# Altium project ZQS_PCB_Project.PrjPcb
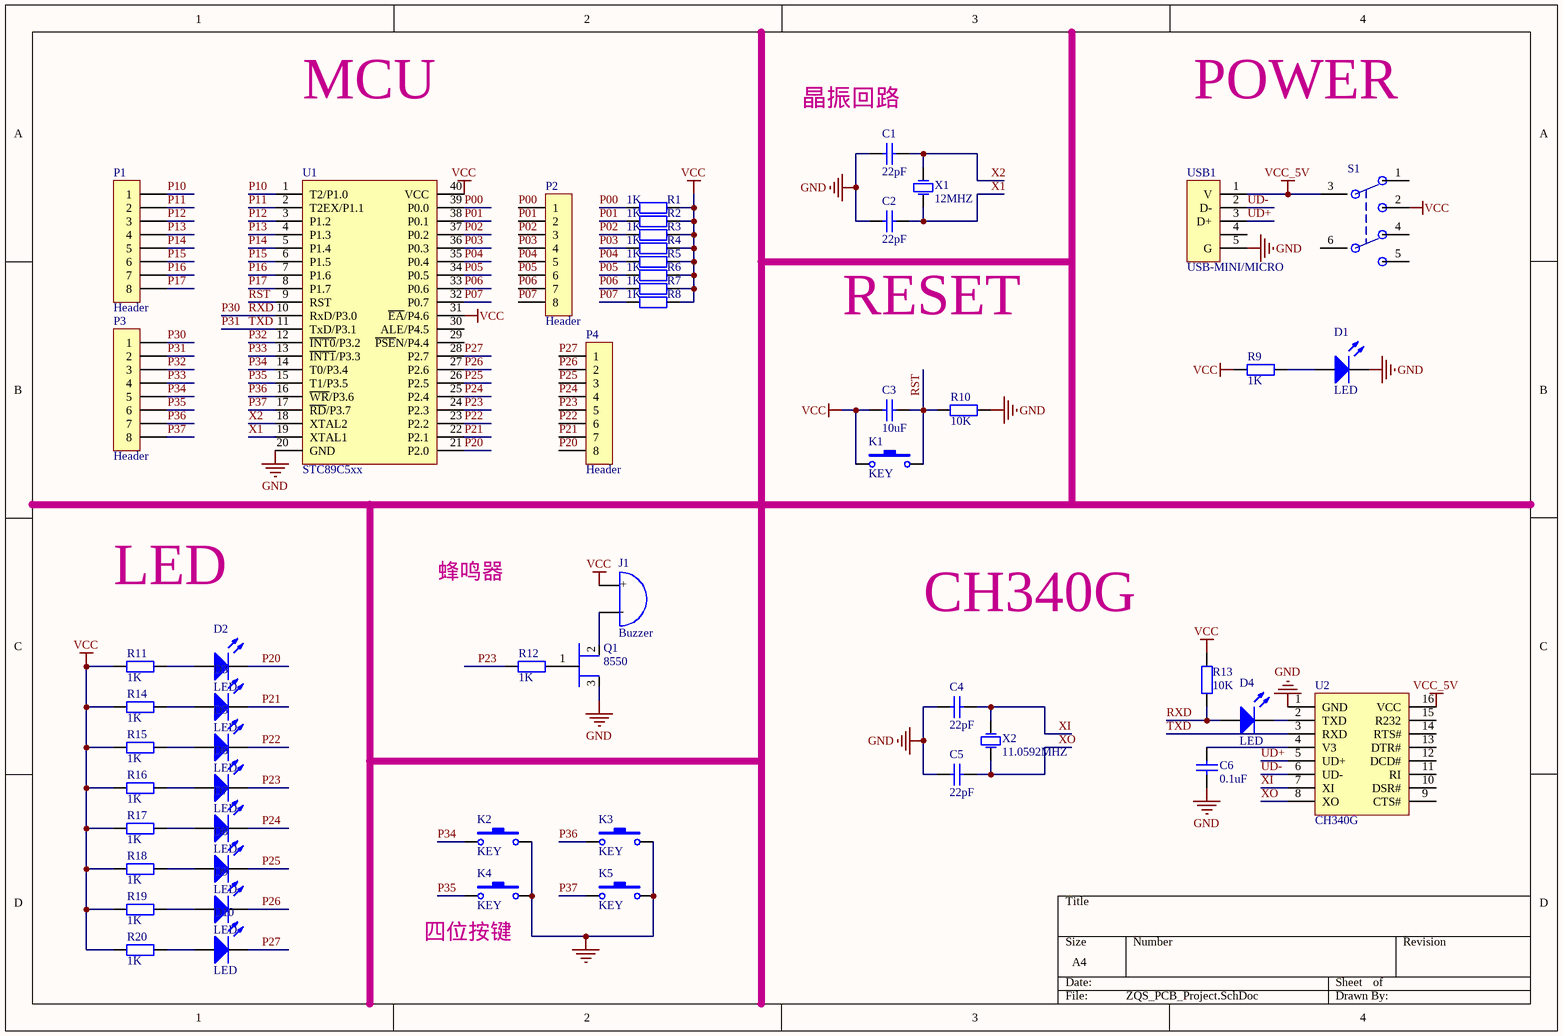
[diagram p0: ZQS_PCB_Project.SchDoc]
1 sheet, 53 parts. Net scope: global (net labels, ports and power ports of the same name join across sheets).
Board file: ZQS_PCB_Project.PcbDoc

## Sheet ZQS_PCB_Project.SchDoc
size A4; SheetNumber: 1; SheetTotal: 1

### Parts
C1  22pF  [C0603]
C2  22pF  [C0603]
C3  10uF  [C0603]
C4  22pF  [C0603]
C5  22pF  [C0603]
C6  0.1uF  [C0603]
D1  LED  [LED-G]
D2  LED  [LED-B]
D3  LED  [LED-B]
D4  LED  [LED-G]
D5  LED  [LED-G]
D6  LED  [LED-G]
D7  LED  [LED-R]
D8  LED  [LED-R]
D9  LED  [LED-Y]
D10  LED  [LED-Y]
J1  Buzzer  [Buzzer]
K1  KEY  [KEY]
K2  KEY  [KEY]
K3  KEY  [KEY]
K4  KEY  [KEY]
K5  KEY  [KEY]
P1  Header  [HDR2.54-M-LI-8P]
P2  Header  [HDR2.54-M-LI-8P]
P3  Header  [HDR2.54-M-LI-8P]
P4  Header  [HDR2.54-M-LI-8P]
Q1  8550  [SOT-23-3]
R1  1K  [R0603]
R2  1K  [R0603]
R3  1K  [R0603]
R4  1K  [R0603]
R5  1K  [R0603]
R6  1K  [R0603]
R7  1K  [R0603]
R8  1K  [R0603]
R9  1K  [R0603]
R10  10K  [R0603]
R11  1K  [R0603]
R12  1K  [R0603]
R13  10K  [R0603]
R14  1K  [R0603]
R15  1K  [R0603]
R16  1K  [R0603]
R17  1K  [R0603]
R18  1K  [R0603]
R19  1K  [R0603]
R20  1K  [R0603]
S1  (no value)  [swtich-6pin]
U1  STC89C5xx  [STC89C5X]
U2  CH340G  [SOIC-16_150mil]
USB1  USB-MINI/MICRO  [USB-MICRO2]
X1  12MHZ  [XTAL_HC49SMD]
X2  11.0592MHZ  [XTAL_HC49SMD]

### Nets
GND: C1.1 C2.1 C4.2 C5.2 C6.1 D1.2(K) K2.2 K3.2 K4.2 K5.2 Q1.3 R10.2 U1.20(GND) U2.1(GND) USB1.5(G)
VCC: C3.1 J1.1(A) K1.1 R1.2 R2.2 R3.2 R4.2 R5.2 R6.2 R7.2 R8.2 R9.1 R11.1 R13.2 R14.1 R15.1 R16.1 R17.1 R18.1 R19.1 R20.1 S1.2 U1.31(~{EA}/P4.6) U1.40(VCC)
VCC_5V: S1.3 U2.16(VCC) USB1.1(V)
P00: P2.1 R1.1 U1.39(P0.0)
P01: P2.2 R2.1 U1.38(P0.1)
P02: P2.3 R3.1 U1.37(P0.2)
P03: P2.4 R4.1 U1.36(P0.3)
P04: P2.5 R5.1 U1.35(P0.4)
P05: P2.6 R6.1 U1.34(P0.5)
P06: P2.7 R7.1 U1.33(P0.6)
P07: P2.8 R8.1 U1.32(P0.7)
P10: P1.1 U1.1(T2/P1.0)
P11: P1.2 U1.2(T2EX/P1.1)
P12: P1.3 U1.3(P1.2)
P13: P1.4 U1.4(P1.3)
P14: P1.5 U1.5(P1.4)
P15: P1.6 U1.6(P1.5)
P16: P1.7 U1.7(P1.6)
P17: P1.8 U1.8(P1.7)
P20: D2.2(K) P4.8 U1.21(P2.0)
P21: D3.2(K) P4.7 U1.22(P2.1)
P22: D5.2(K) P4.6 U1.23(P2.2)
P23: D6.2(K) P4.5 R12.1 U1.24(P2.3)
P24: D7.2(K) P4.4 U1.25(P2.4)
P25: D8.2(K) P4.3 U1.26(P2.5)
P26: D9.2(K) P4.2 U1.27(P2.6)
P27: D10.2(K) P4.1 U1.28(P2.7)
P30: D4.1(A) P3.1 R13.1 U1.10(RxD/P3.0)  [also labelled RXD]
P31: P3.2 U1.11(TxD/P3.1) U2.3(RXD)  [also labelled TXD]
P32: P3.3 U1.12(~{INT0}/P3.2)
P33: P3.4 U1.13(~{INT1}/P3.3)
P34: K2.1 P3.5 U1.14(T0/P3.4)
P35: K4.1 P3.6 U1.15(T1/P3.5)
P36: K3.1 P3.7 U1.16(~{WR}/P3.6)
P37: K5.1 P3.8 U1.17(~{RD}/P3.7)
RST: C3.2 K1.2 R10.1 U1.9(RST)
UD+: U2.5(UD+) USB1.3(D+)
UD-: U2.6(UD-) USB1.2(D-)
X1: C2.2 U1.19(XTAL1) X1.1(OSC1)
X2: C1.2 U1.18(XTAL2) X1.2(OSC2)
XI: C4.1 U2.7(XI) X2.1(OSC1)
XO: C5.1 U2.8(XO) X2.2(OSC2)
NetC6_2: C6.2 U2.4(V3)
NetD1_1: D1.1(A) R9.2
NetD2_1: D2.1(A) R11.2
NetD3_1: D3.1(A) R14.2
NetD4_2: D4.2(K) U2.2(TXD)
NetD5_1: D5.1(A) R15.2
NetD6_1: D6.1(A) R16.2
NetD7_1: D7.1(A) R17.2
NetD8_1: D8.1(A) R18.2
NetD9_1: D9.1(A) R19.2
NetD10_1: D10.1(A) R20.2
NetJ1_2: J1.2(B) Q1.2
NetQ1_1: Q1.1 R12.2

Not connected (* = marked no-connect by the designer): S1 1 4 5 6; U1 29(~{PSE}N/P4.4) 30(ALE/P4.5); U2 9(CTS#) 10(DSR#) 11(RI) 12(DCD#) 13(DTR#) 14(RTS#) 15(R232); USB1 4

### Notes on the sheet
- MCU
- (near C1) 晶振回路
- POWER
- (near C2) RESET
- 蜂鸣器
- LED
- CH340G
- (near K4) 四位按键
- (in symbol Buzzer) +; -

### Library data of the parts
C1-C6 = CAP
P1-P4 = Header1x8
Q1 = Triode-3
R1-R20 = RES
S1 = SWITCH-6PIN
USB1 = USB-MICRO
X1 X2 = XTAL